# EAGLE design PCB Telemetria 2020 (EAGLE 9.5.2)

## Sheet 1 of 3: TBEAM
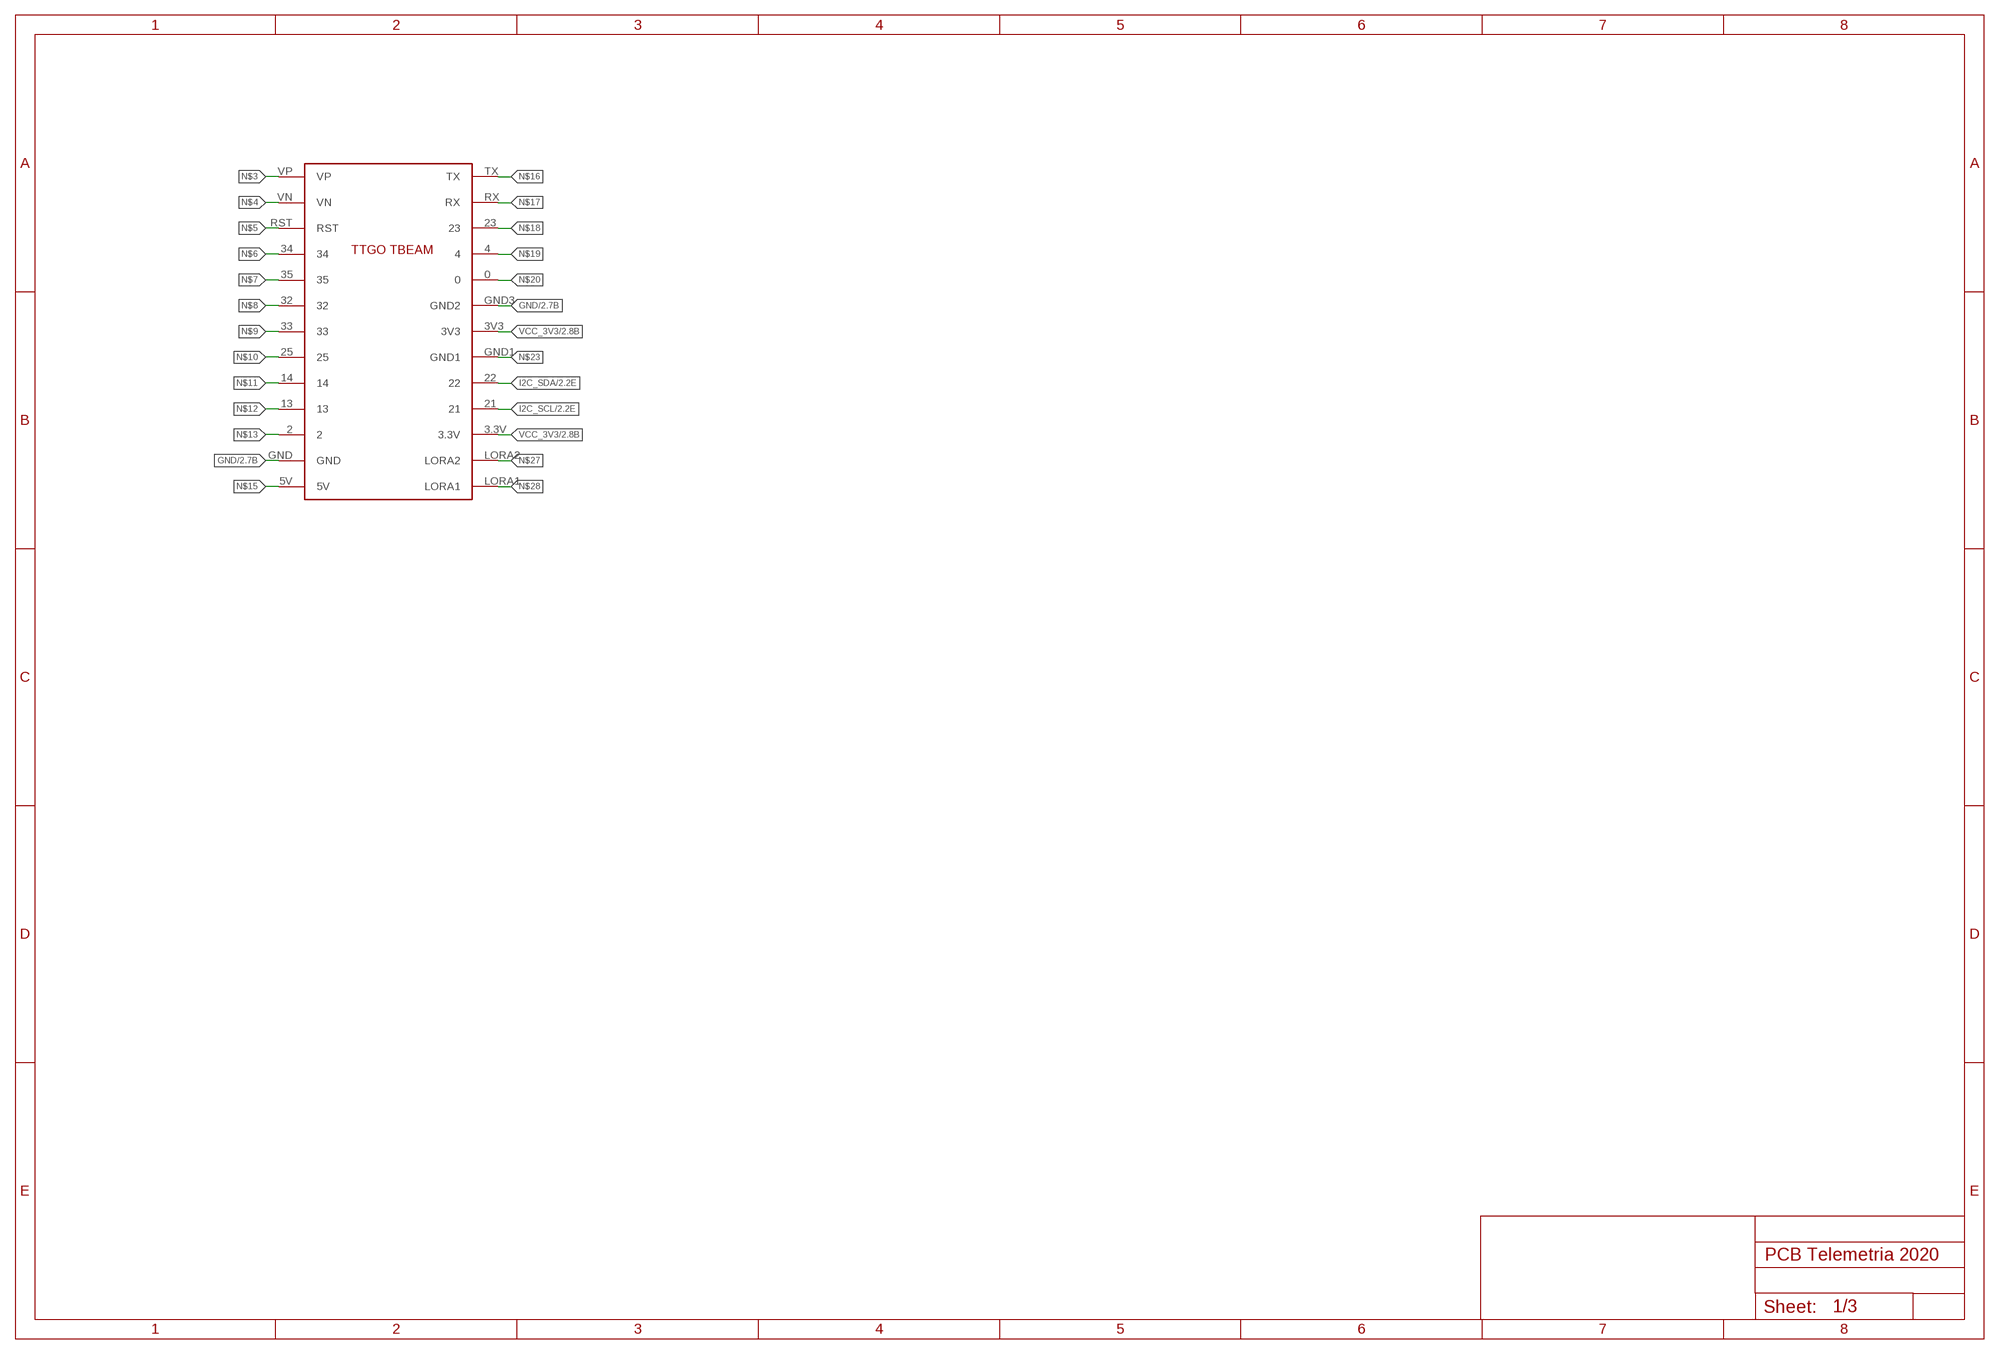
[diagram p0: schematic, sheet 1]

### Parts
U$1  TTGOBEAM  [TTGOBEAM]

### Nets
GND: U$1.GND U$1.GND3(GND2) ; also sheet 2,3
I2C_SCL: U$1.21 ; also sheet 2
I2C_SDA: U$1.22 ; also sheet 2
N$3: U$1.VP
N$4: U$1.VN
N$5: U$1.RST
N$6: U$1.34
N$7: U$1.35
N$8: U$1.32
N$9: U$1.33
N$10: U$1.25
N$11: U$1.14
N$12: U$1.13
N$13: U$1.2
N$15: U$1.5V
N$16: U$1.TX
N$17: U$1.RX
N$18: U$1.23
N$19: U$1.4
N$20: U$1.0
N$23: U$1.GND1
N$27: U$1.LORA2
N$28: U$1.LORA1
VCC_3V3: U$1.3.3V U$1.3V3 ; also sheet 2,3

## Sheet 2 of 3: Analog Circuits
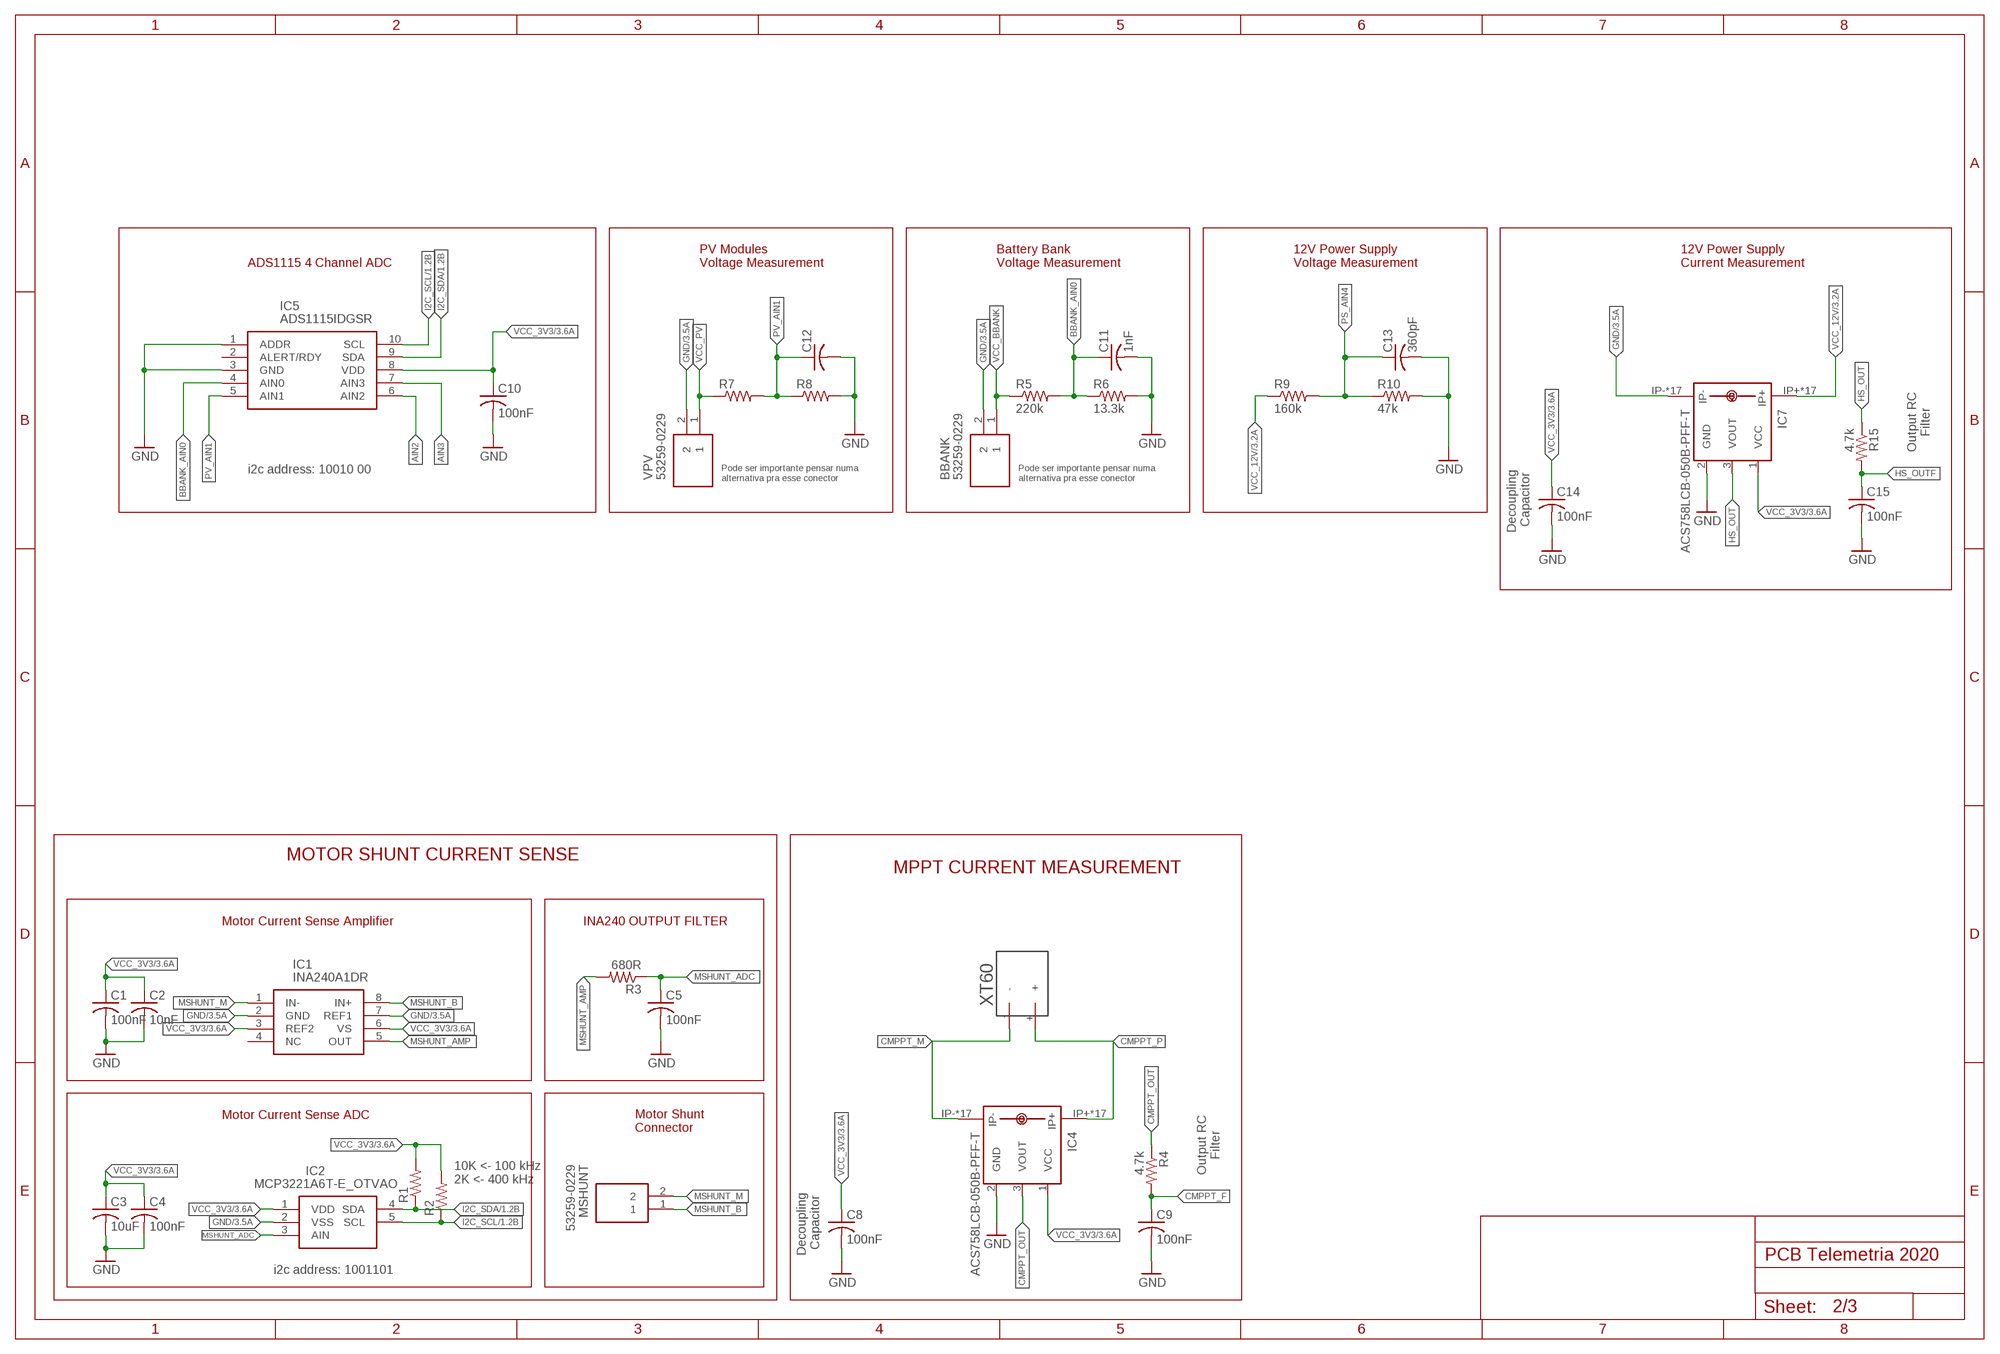
[diagram p1: schematic, sheet 2]

### Parts
BBANK  53259-0229  [0532590229]
C1  100nF  C-USC0805  [C0805]
C2  10nF  C-USC0805  [C0805]
C3  10uF  C-USC0805  [C0805]
C4  100nF  C-USC0805  [C0805]
C5  100nF  C-USC0805  [C0805]
C8  100nF  C-USC0805  [C0805]
C9  100nF  C-USC0805  [C0805]
C10  100nF  C-USC0805  [C0805]
C11  1nF  C-USC0805  [C0805]
C12  C-USC0805  [C0805]
C13  360pF  C-USC0805  [C0805]
C14  100nF  C-USC0805  [C0805]
C15  100nF  C-USC0805  [C0805]
IC1  INA240A1DR  [SOIC127P600X175-8N]
IC2  MCP3221A6T-E_OTVAO  [SOT95P280X145-5N]
IC4  ACS758LCB-050B-PFF-T  [CB-PFF]
IC5  ADS1115IDGSR  [SOP50P490X110-10N]
IC7  ACS758LCB-050B-PFF-T  [CB-PFF]
MSHUNT  53259-0229  [0532590229]
R1  R-US_R0805  [R0805]
R2  R-US_R0805  [R0805]
R3  680R  R-US_R0805  [R0805]
R4  4.7k  R-US_R0805  [R0805]
R5  220k  R-US_R0805  [R0805]
R6  13.3k  R-US_R0805  [R0805]
R7  R-US_R0805  [R0805]
R8  R-US_R0805  [R0805]
R9  160k  R-US_R0805  [R0805]
R10  47k  R-US_R0805  [R0805]
R15  4.7k  R-US_R0805  [R0805]
U$3  XT60  [XT60]
VPV  53259-0229  [0532590229]

### Nets
AIN2: IC5.6(AIN2)
AIN3: IC5.7(AIN3)
BBANK_AIN0: C11.1 IC5.4(AIN0) R5.2 R6.1
CMPPT_F: C9.1 R4.2
CMPPT_M: IC4.IP- IC4.IP-@2(IP-) IC4.IP-@3(IP-) IC4.IP-@4(IP-) IC4.IP-@5(IP-) IC4.IP-@6(IP-) IC4.IP-@7(IP-) IC4.IP-@8(IP-) IC4.IP-@9(IP-) IC4.IP-@10(IP-) IC4.IP-@11(IP-) IC4.IP-@12(IP-) IC4.IP-@13(IP-) IC4.IP-@14(IP-) IC4.IP-@15(IP-) IC4.IP-@16(IP-) IC4.IP-@17(IP-) U$3.-
CMPPT_OUT: IC4.3(VOUT) R4.1
CMPPT_P: IC4.IP+ IC4.IP+@2(IP+) IC4.IP+@3(IP+) IC4.IP+@4(IP+) IC4.IP+@5(IP+) IC4.IP+@6(IP+) IC4.IP+@7(IP+) IC4.IP+@8(IP+) IC4.IP+@9(IP+) IC4.IP+@10(IP+) IC4.IP+@11(IP+) IC4.IP+@12(IP+) IC4.IP+@13(IP+) IC4.IP+@14(IP+) IC4.IP+@15(IP+) IC4.IP+@16(IP+) IC4.IP+@17(IP+) U$3.+
GND: BBANK.2 C1.2 C2.2 C3.2 C4.2 C5.2 C8.2 C9.2 C10.2 C11.2 C12.2 C13.2 C14.2 C15.2 IC1.2(GND) IC1.7(REF1) IC2.2(VSS) IC4.2(GND) IC5.1(ADDR) IC5.3(GND) IC7.2(GND) IC7.IP- IC7.IP-@2(IP-) IC7.IP-@3(IP-) IC7.IP-@4(IP-) IC7.IP-@5(IP-) IC7.IP-@6(IP-) IC7.IP-@7(IP-) IC7.IP-@8(IP-) IC7.IP-@9(IP-) IC7.IP-@10(IP-) IC7.IP-@11(IP-) IC7.IP-@12(IP-) IC7.IP-@13(IP-) IC7.IP-@14(IP-) IC7.IP-@15(IP-) IC7.IP-@16(IP-) IC7.IP-@17(IP-) R6.2 R8.2 R10.2 VPV.2 ; also sheet 1,3
HS_OUT: IC7.3(VOUT) R15.1
HS_OUTF: C15.1 R15.2
I2C_SCL: IC2.5(SCL) IC5.10(SCL) R2.1 ; also sheet 1
I2C_SDA: IC2.4(SDA) IC5.9(SDA) R1.1 ; also sheet 1
MSHUNT_ADC: C5.1 IC2.3(AIN) R3.1
MSHUNT_AMP: IC1.5(OUT) R3.2
MSHUNT_B: IC1.8(IN+) MSHUNT.1
MSHUNT_M: IC1.1(IN-) MSHUNT.2
PS_AIN4: C13.1 R9.2 R10.1
PV_AIN1: C12.1 IC5.5(AIN1) R7.2 R8.1
VCC_3V3: C1.1 C2.1 C3.1 C4.1 C8.1 C10.1 C14.1 IC1.3(REF2) IC1.6(VS) IC2.1(VDD) IC4.1(VCC) IC5.8(VDD) IC7.1(VCC) R1.2 R2.2 ; also sheet 1,3
VCC_12V: IC7.IP+ IC7.IP+@2(IP+) IC7.IP+@3(IP+) IC7.IP+@4(IP+) IC7.IP+@5(IP+) IC7.IP+@6(IP+) IC7.IP+@7(IP+) IC7.IP+@8(IP+) IC7.IP+@9(IP+) IC7.IP+@10(IP+) IC7.IP+@11(IP+) IC7.IP+@12(IP+) IC7.IP+@13(IP+) IC7.IP+@14(IP+) IC7.IP+@15(IP+) IC7.IP+@16(IP+) IC7.IP+@17(IP+) R9.1 ; also sheet 3
VCC_BBANK: BBANK.1 R5.1
VCC_PV: R7.1 VPV.1
Unconnected: IC1.4(NC) IC5.2(ALERT/RDY)

### Notes on the sheet
- ADS1115 4 Channel ADC
- PV Modules
  Voltage Measurement
- Battery Bank
  Voltage Measurement
- 12V Power Supply
  Voltage Measurement
- 12V Power Supply
  Current Measurement
- Output RC
  Filter
- i2c address: 10010 00
- Pode ser importante pensar numa
  alternativa pra esse conector
- Pode ser importante pensar numa
  alternativa pra esse conector
- Decoupling 
  Capacitor
- MOTOR SHUNT CURRENT SENSE
- MPPT CURRENT MEASUREMENT
- Motor Current Sense Amplifier | INA240 OUTPUT FILTER
- Motor Current Sense ADC
- Motor Shunt 
  Connector
- Output RC
  Filter
- 10K <- 100 kHz
  2K <- 400 kHz
- Decoupling 
  Capacitor
- i2c address: 1001101

## Sheet 3 of 3: Power
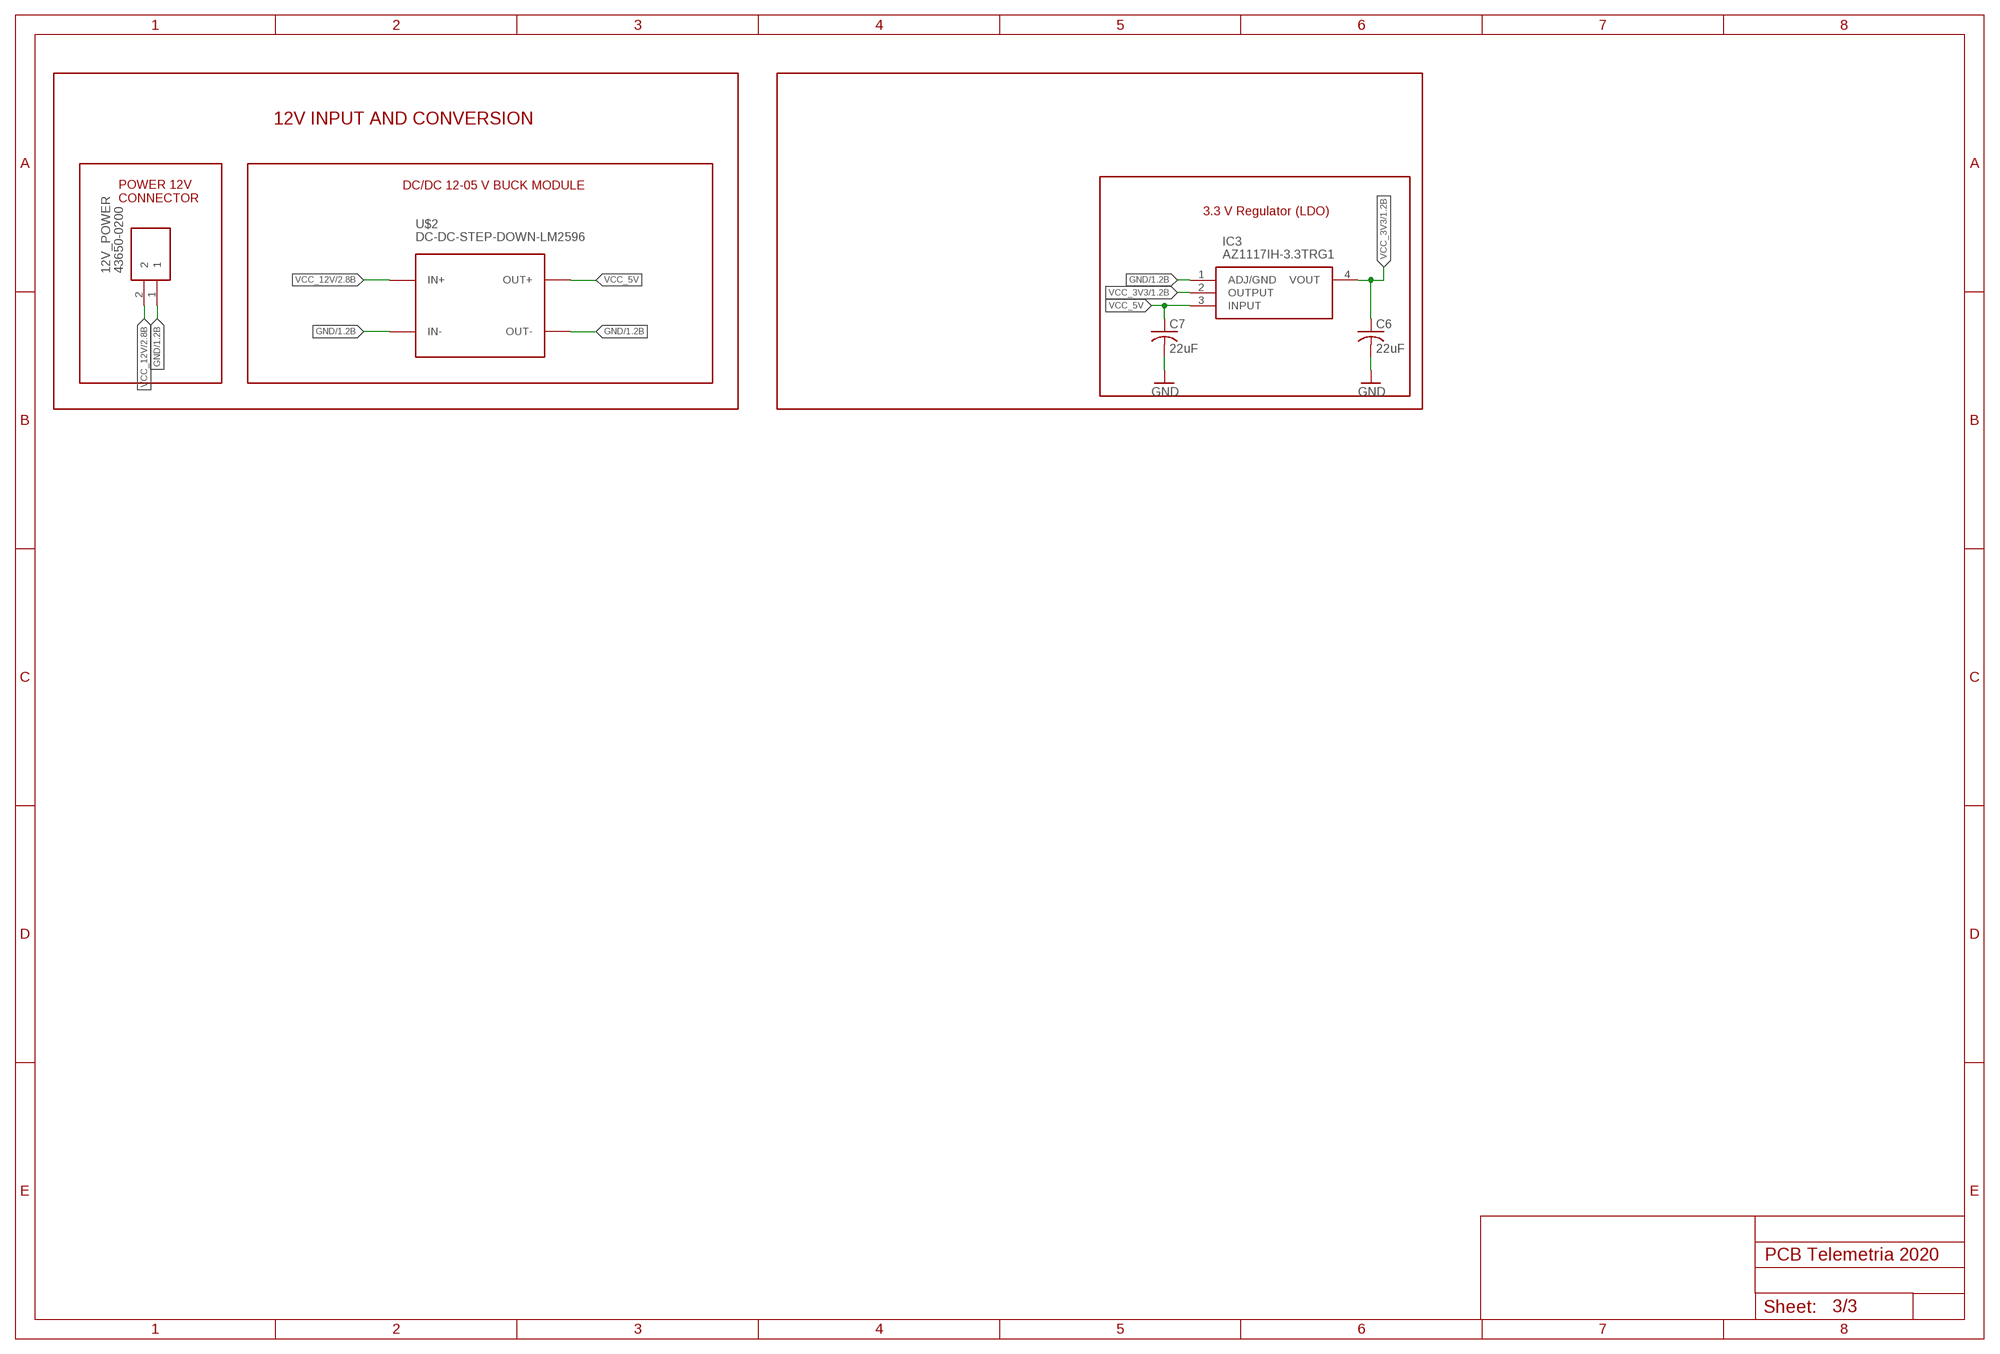
[diagram p2: schematic, sheet 3]

### Parts
12V_POWER  43650-0200  [43650-0200]
C6  22uF  C-USC0805  [C0805]
C7  22uF  C-USC0805  [C0805]
IC3  AZ1117IH-3.3TRG1  [SOT230P700X170-4N]
U$2  DC-DC-STEP-DOWN-LM2596  [DC-DC-STEP-DOWN-LM2596]

### Nets
GND: 12V_POWER.1 C6.2 C7.2 IC3.1(ADJ/GND) U$2.IN- U$2.OUT- ; also sheet 1,2
VCC_3V3: C6.1 IC3.2(OUTPUT) IC3.4(VOUT) ; also sheet 1,2
VCC_5V: C7.1 IC3.3(INPUT) U$2.OUT+
VCC_12V: 12V_POWER.2 U$2.IN+ ; also sheet 2

### Notes on the sheet
- 12V INPUT AND CONVERSION
- DC/DC 12-05 V BUCK MODULE
- POWER 12V
  CONNECTOR
- 3.3 V Regulator (LDO)

## Library data of the parts
12V_POWER = 43650-0200:43650-0200: Header 3.00mm, WTB single row, RA, 2w Molex MICRO-FIT 3.0 Series, Series Number 43650, 3mm Pitch 2 Way 1 Row Shrouded Right Angle PCB Header, Through Hole Source: Datasheet <http://www.molex.com/pdm_docs/sd/436500200_sd.pdf>; DESCRIPTION: Header 3.00mm, WTB single row, RA, 2w Molex MICRO-FIT 3.0 Series, Series Number 43650, 3mm Pitch 2 Way 1 Row Shrouded Right Angle PCB Header, Through Hole; HEIGHT: mm; MANUFACTURER_NAME: Molex; MANUFACTURER_PART_NUMBER: 43650-0200; MOUSER_PART_NUMBER: 538-43650-0200; MOUSER_PRICE-STOCK: https://www.mouser.co.uk/ProductDetail/Molex/43650-0200?qs=HlEFOAM0q6XGaAJJj3Pssw%3D%3D
BBANK MSHUNT VPV = CON_MOLEX_53259-0229:53259-0229: Headers & Wire Housings 3.5 WtB Wafer Assy R B Wafer Assy RA 2Ckt Source: Datasheet <https://www.molex.com/webdocs/datasheets/pdf/en-us/0532590229_PCB_HEADERS.pdf>; DESCRIPTION: Headers & Wire Housings 3.5 WtB Wafer Assy R B Wafer Assy RA 2Ckt; HEIGHT: 7mm; MANUFACTURER_NAME: Molex; MANUFACTURER_PART_NUMBER: 53259-0229; MOUSER_PART_NUMBER: 538-53259-0229; MOUSER_PRICE-STOCK: https://www.mouser.co.uk/ProductDetail/Molex/53259-0229?qs=%2Fy5FSpUmAiGN4PmFvaThpA%3D%3D
C1-C15 = rcl:C-US: CAPACITOR, American symbol; SPICEPREFIX: C
IC1 = INA240A1DR:INA240A1DR: 80V, Low-/High-Side, Bi-Directional, Zero-Drift, Current Sense Amp w/Enhanced PWM Rejection Source: Datasheet <http://www.ti.com/lit/gpn/ina240>; DESCRIPTION: 80V, Low-/High-Side, Bi-Directional, Zero-Drift, Current Sense Amp w/Enhanced PWM Rejection; HEIGHT: 1.75mm; MANUFACTURER_NAME: Texas Instruments; MANUFACTURER_PART_NUMBER: INA240A1DR; MOUSER_PART_NUMBER: 595-INA240A1DR; MOUSER_PRICE-STOCK: https://www.mouser.co.uk/ProductDetail/Texas-Instruments/INA240A1DR?qs=AQlKX63v8Rv7XB07RTzuHA%3D%3D
IC2 = MCP3221A6T-E_OTVAO:MCP3221A6T-E_OTVAO: Analog to Digital Converters - ADC Automotive, 12-bit SAR ADC, I2C, single channel Source: Datasheet <https://www.arrow.com/en/products/mcp3221a6t-eotvao/microchip-technology>; DESCRIPTION: Analog to Digital Converters - ADC Automotive, 12-bit SAR ADC, I2C, single channel; HEIGHT: 1.45mm; MANUFACTURER_NAME: Microchip; MANUFACTURER_PART_NUMBER: MCP3221A6T-E/OTVAO; MOUSER_PART_NUMBER: 579-MCP3221A6TEOTVAO; MOUSER_PRICE-STOCK: https://www.mouser.co.uk/ProductDetail/Microchip-Technology/MCP3221A6T-E-OTVAO?qs=5aG0NVq1C4xIe7K3D%2FHE6g%3D%3D
IC3 = AZ1117IH-3.3TRG1:AZ1117IH-3.3TRG1: LDO Voltage Regulators LDO BJT HiCurr 1.35A 10Hz to 10KHz Source: Datasheet; DESCRIPTION: LDO Voltage Regulators LDO BJT HiCurr 1.35A 10Hz to 10KHz; HEIGHT: 1.7mm; MANUFACTURER_NAME: Diodes Inc.; MANUFACTURER_PART_NUMBER: AZ1117IH-3.3TRG1; MOUSER_PART_NUMBER: 621-AZ1117IH-3.3TRG1; MOUSER_PRICE-STOCK: https://www.mouser.co.uk/ProductDetail/Diodes-Incorporated/AZ1117IH-33TRG1?qs=cpo3%2FpBou2jnS4SxLgAVoA%3D%3D
IC4 IC7 = allegro:ACS758*: Thermally Enhanced, Fully Integrated, Hall Effect-Based Linear Current Sensor with 100 micro Ohm Current Conductor display layer 49 Reference in BRD and place VIAs on circles Source: http://www.allegromicro.com/en/Products/Part_Numbers/0758/0758.pdf; MPN: ACS758LCB-050B-PFF-T; OC_FARNELL: 1718997; OC_NEWARK: 04R7131
IC5 = SamacSys_Parts:ADS1115IDGSR: 16-Bit 860SPS 4-Ch Delta-Sigma ADC With PGA, Oscillator, Vref, Comparator, and I2C Source: Datasheet <http://www.ti.com/lit/gpn/ADS1115>; DESCRIPTION: 16-Bit 860SPS 4-Ch Delta-Sigma ADC With PGA, Oscillator, Vref, Comparator, and I2C; HEIGHT: 1.1mm; MANUFACTURER_NAME: Texas Instruments; MANUFACTURER_PART_NUMBER: ADS1115IDGSR; MOUSER_PART_NUMBER: 595-ADS1115IDGSR; MOUSER_PRICE-STOCK: https://www.mouser.co.uk/ProductDetail/Texas-Instruments/ADS1115IDGSR?qs=IK5e5L0zOXjKCJoVMhYO%2FQ%3D%3D
R1-R10 R15 = rcl:R-US_: RESISTOR, American symbol; SPICEPREFIX: R
U$1 = bibliotecattgo:TTGOBEAM
U$2 = diy-modules:DC-DC-STEP-DOWN-LM2596: DC/DC Step-Down Regulator based on LM2596-ADJ chip LM2596 datasheet available here: http://www.ti.com/lit/ds/symlink/lm2596.pdf Click here to find device on ebay.com <http://www.ebay.com/sch/lm2596+power+regulator>
U$3 = XT60:XT60: XT60

## Board
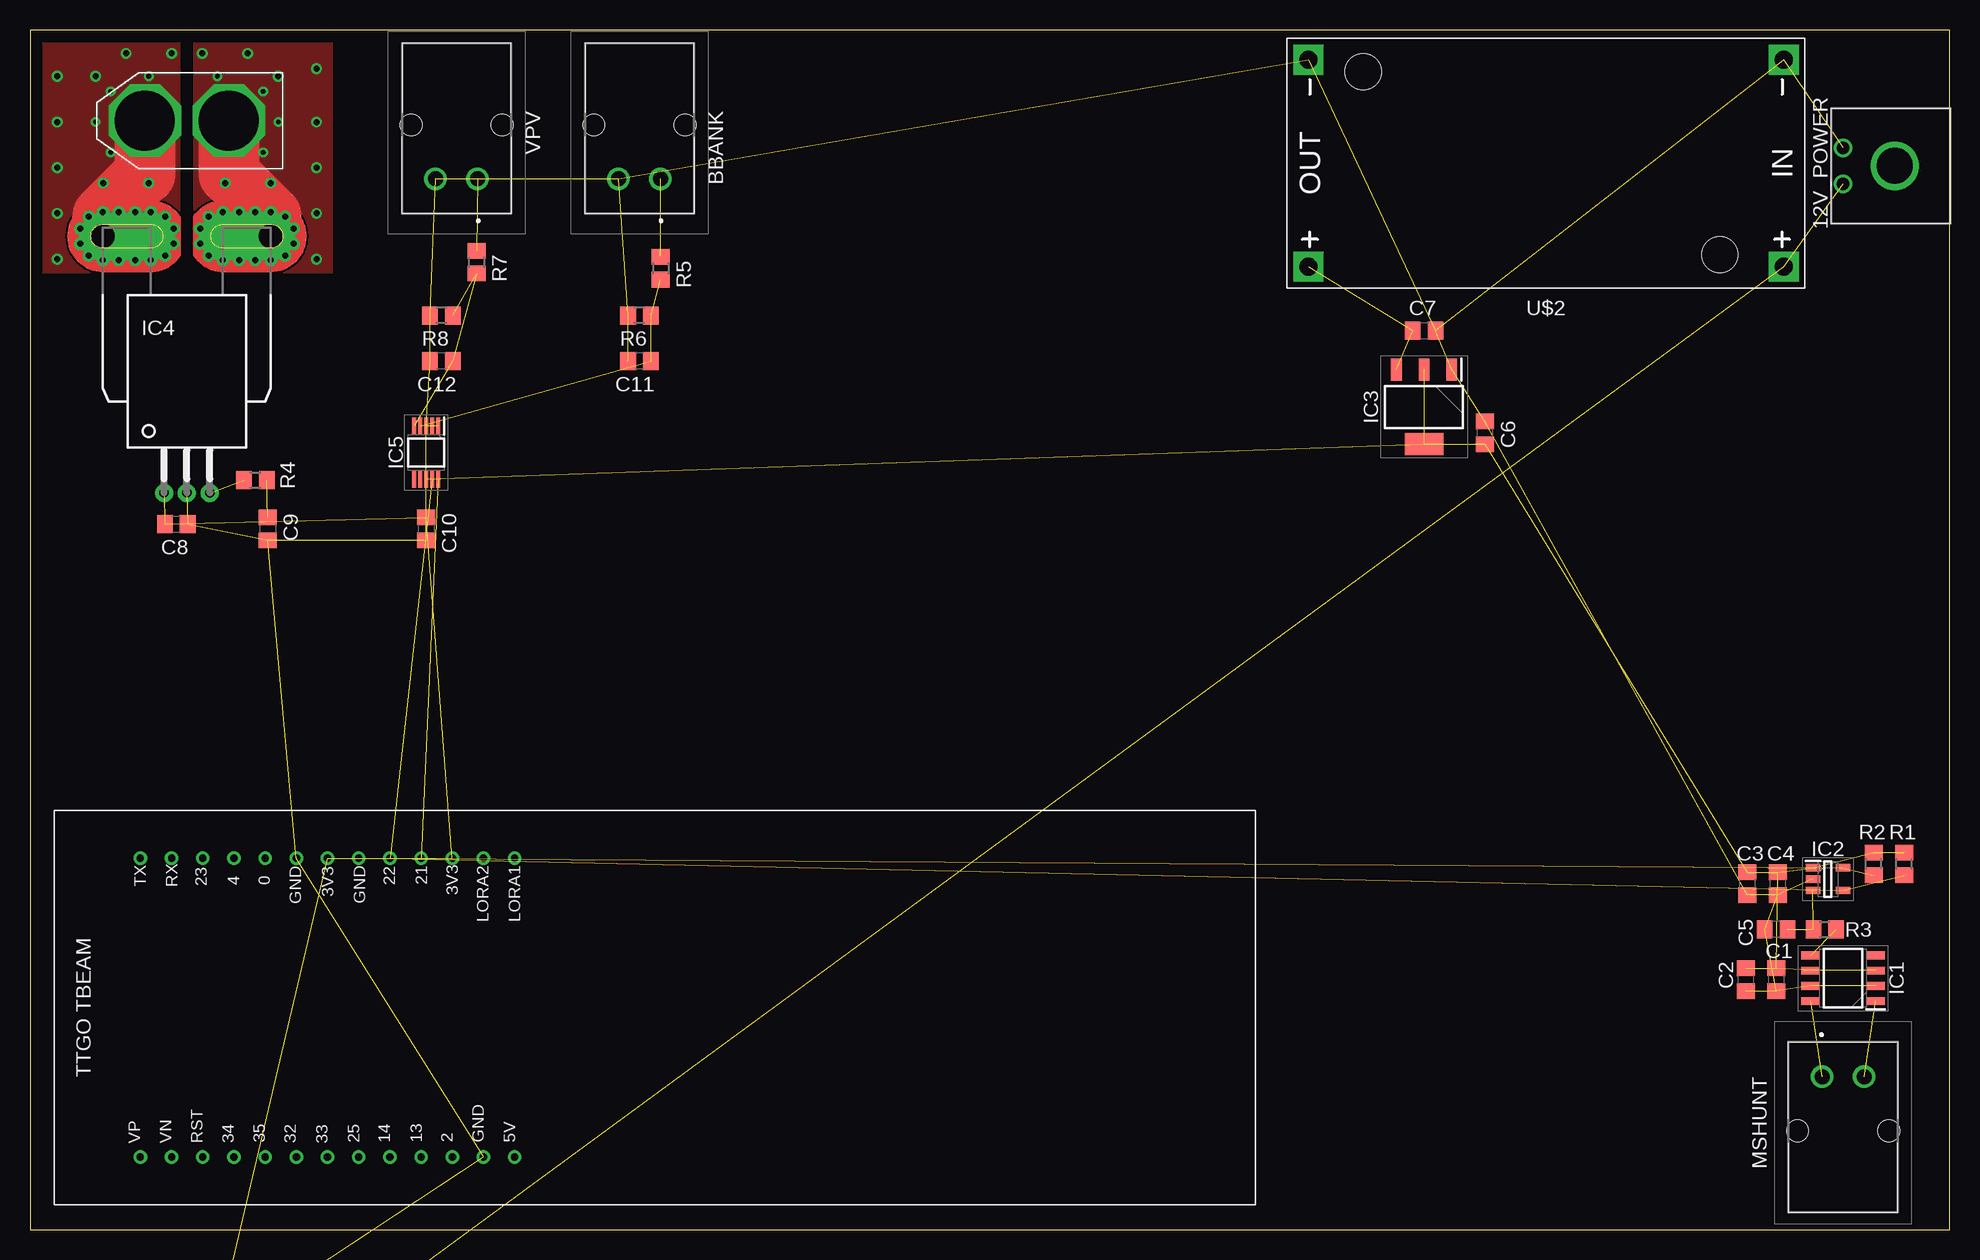
[diagram p3: board, top side]
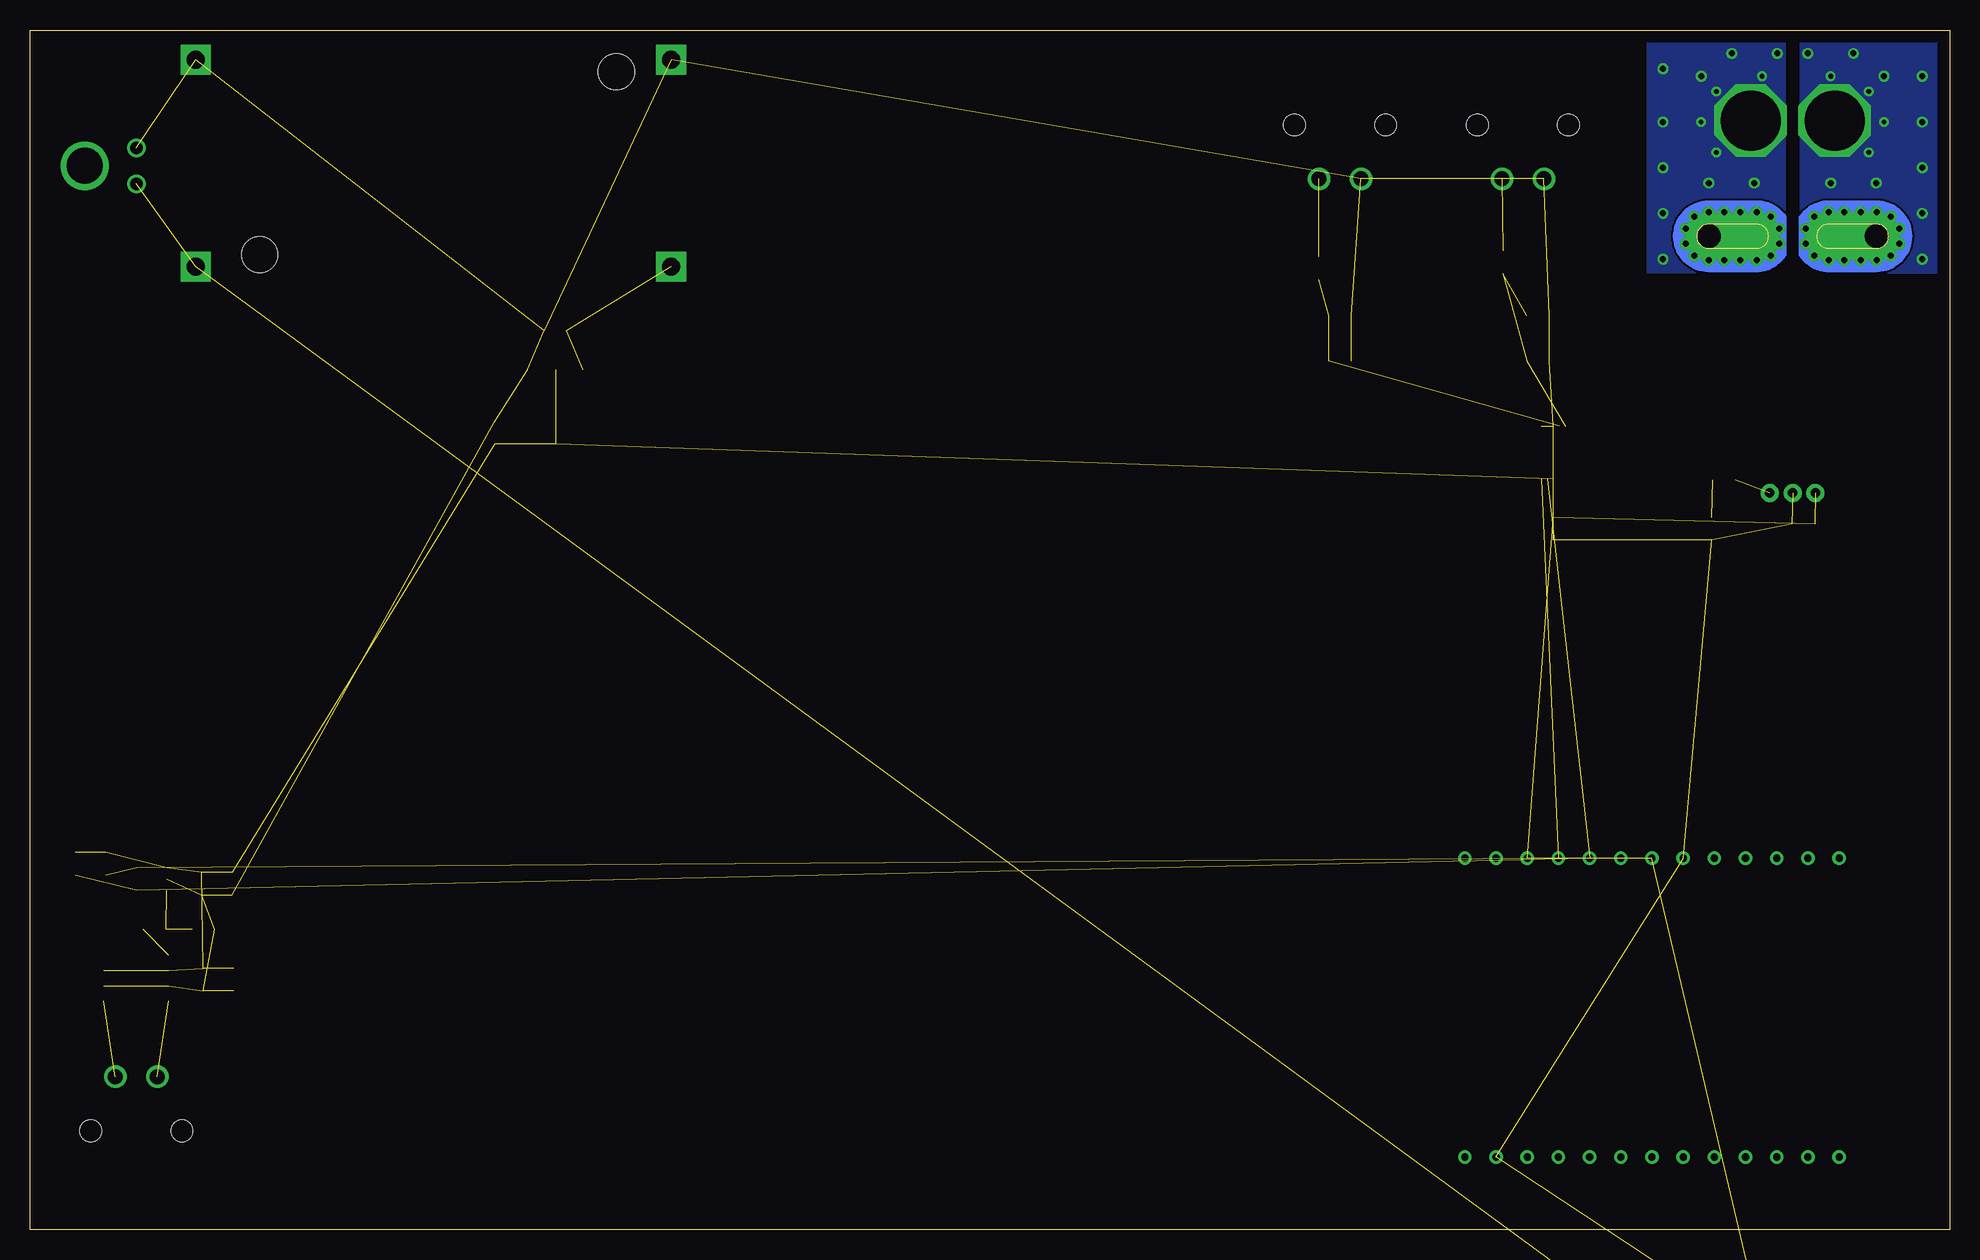
[diagram p4: board, bottom side, seen from below]

Size 160 x 100 mm. Coordinates in mm from the lower left corner, seen from the top.
Outline: 0,0 160,0 160,100 0,100 0,0
Copper layers (1*16): Top 0.035mm / dielectric 1.5mm / Bottom 0.035mm
Design rules "default *": minimum track width 6mil, minimum drill 0.35mm, track to track 6mil, track to pad 6mil, pad to pad 6mil, via to via 6mil, smd to smd 6mil, copper to edge 40mil, drill to drill 6mil, minimum pad ring 10mil, minimum via ring 8mil, stop-mask expansion 4mil, vias tented up to drill 0mil, thermal gap 10mil

### Footprints (pad centres in the part's own frame; a part is rotated, then mirrored left to right if it is on the bottom)
43650-0200 = drill 1.02 pad 1.52: 1 0,0; 2 -3,0 | drill 3 pad 3: 3 -1.5,-4.32
0532590229 = drill 1.25 pad 1.875: 1 -1.75,3.85; 2 1.75,3.85 | hole 1.8: 3.8,-0.65; -3.8,-0.65
C0805 = smd 1.3 x 1.5: 1 -0.95,0; 2 0.95,0
SOIC127P600X175-8N = smd 1.528 x 0.65: 1 -2.711,1.905; 2 -2.711,0.635; 3 -2.711,-0.635; 4 -2.711,-1.905; 5 2.711,-1.905; 6 2.711,-0.635; 7 2.711,0.635; 8 2.711,1.905
SOT95P280X145-5N = smd 1.2 x 0.6: 1 -1.25,0.95; 2 -1.25,0; 3 -1.25,-0.95; 4 1.25,-0.95; 5 1.25,0.95
SOT230P700X170-4N = smd 1.85 x 0.9: 1 -3.1,2.3; 2 -3.1,0; 3 -3.1,-2.3 | smd 1.85 x 3.2: 4 3.1,0
CB-PFF = drill 0.8 pad 1.5: 1 -1.91,-21.4; 2 0,-21.4; 3 1.91,-21.4 | drill 2 pad 4 offset: IP+ 7,0; IP- -7,0 | drill 0.5 pad 0.9: IP+@2 8.89,0.635; IP+@3 8.89,-0.635; IP+@4 8.175,-1.625; IP+@5 7,-2; IP+@6 5.675,-2; IP+@7 4.35,-2; IP+@8 3,-2; IP+@9 1.825,-1.625; IP+@10 1.1,-0.625; IP+@11 1.1,0.625; IP+@12 1.825,1.625; IP+@13 3,2; IP+@14 4.35,2; IP+@15 5.675,2; IP+@16 7,2; IP+@17 8.175,1.625; IP-@2 -8.89,0.635; IP-@3 -8.89,-0.635; IP-@4 -8.175,-1.625; IP-@5 -7,-2; IP-@6 -5.675,-2; IP-@7 -4.325,-2; IP-@8 -3,-2; IP-@9 -1.825,-1.625; IP-@10 -1.1,-0.625; IP-@11 -1.1,0.625; IP-@12 -1.825,1.625; IP-@13 -3,2; IP-@14 -4.325,2; IP-@15 -5.675,2; IP-@16 -7,2; IP-@17 -8.175,1.625
SOP50P490X110-10N = smd 1.4 x 0.3: 1 -2.2,1; 2 -2.2,0.5; 3 -2.2,0; 4 -2.2,-0.5; 5 -2.2,-1; 6 2.2,-1; 7 2.2,-0.5; 8 2.2,0; 9 2.2,0.5; 10 2.2,1
R0805 = smd 1.3 x 1.5: 1 -0.95,0; 2 0.95,0
TTGOBEAM = drill 0.6: 0 11.9,5.8; 2 -13,-9.8; 3.3V 11.9,-9.8; 3V3 11.9,0.6; 4 11.9,8.4; 5V -13,-15; 13 -13,-7.2; 14 -13,-4.6; 21 11.9,-7.2; 22 11.9,-4.6; 23 11.9,11; 25 -13,-2; 32 -13,3.2; 33 -13,0.6; 34 -13,8.4; 35 -13,5.8; GND -13,-12.4; GND1 11.9,-2; GND3 11.9,3.2; LORA1 11.9,-15; LORA2 11.9,-12.4; RST -13,11; RX 11.9,13.6; TX 11.9,16.2; VN -13,13.6; VP -13,16.2
DC-DC-STEP-DOWN-LM2596 = drill 1.5 pad 2.5 square: IN+ -19.812,8.636; IN- -19.812,-8.636; OUT+ 19.812,8.636; OUT- 19.812,-8.636 | hole 3: -14.478,7.62; 15.24,-7.62
XT60 = drill 5 octagon: + 4.5,0; - 11.5,0

### Placement (x,y rotation side)
12V_POWER  151.13,90.17 90 top
BBANK  50.8,91.44 180 top
C1  145.54,20.83 270 top
C2  143,20.83 270 top
C3  143.13,28.83 270 top
C4  145.67,28.83 270 top
C5  145.54,25.02 180 top
C6  121.28,66.42 90 top
C7  116.2,74.93 0 top
C8  12.19,58.8 0 top
C9  19.81,58.42 270 top
C10  33.02,58.42 270 top
C11  50.8,72.39 180 top
C12  34.29,72.39 180 top
C13  3.81,-38.1 0 top  (outside the outline)
C14  10.16,-38.1 0 top  (outside the outline)
C15  16.51,-38.1 0 top  (outside the outline)
IC1  151.13,20.95 180 top
IC2  149.86,29.21 0 top
IC3  116.2,68.58 270 top
IC4  13.08,82.8 0 top
IC5  33.02,64.77 270 top
IC7  11.43,-12.7 0 top  (outside the outline)
MSHUNT  151.13,8.89 0 top
R1  156.21,30.48 90 top
R2  153.67,30.48 90 top
R3  149.61,25.02 0 top
R4  18.8,62.48 0 top
R5  52.58,80.14 270 top
R6  50.8,76.2 180 top
R7  37.21,80.64 270 top
R8  34.29,76.2 180 top
R9  22.86,-38.1 0 top  (outside the outline)
R10  3.81,-44.45 0 top  (outside the outline)
R15  29.21,-38.1 0 top  (outside the outline)
U$1  25.4,19.05 90 top
U$2  126.36,88.9 180 top
U$3  21.08,92.46 180 top
VPV  35.56,91.44 180 top

### Tracks (layer width: path | path; a pad name or v marks a point on that pad's centre or on a via)
BBANK_AIN0  (3 unrouted)
CMPPT_F  (1 unrouted)
CMPPT_M  (via drill 0.4 pad 0.55, 0.5 pad 0.75)
  Top 5.08: IC4.IP- 6.08,84.51 9.58,88.01 U$3.-
  other vias: 2.29,80.9 2.29,84.71 2.29,88.52 2.29,92.33 2.29,96.14 6.1,87.25 9.91,87.25 5.46,96.14 8,98.04 11.81,98.04 9.91,96.14 6.73,94.87 5.46,92.33 6.73,89.79
  pour Top (no thermals): 1.02,79.76 1.02,98.93 12.45,98.93 12.45,79.76
  pour Bottom (no thermals): 1.02,79.76 1.02,98.93 12.45,98.93 12.45,79.76
CMPPT_OUT  (1 unrouted)
CMPPT_P  (via drill 0.4 pad 0.55, 0.5 pad 0.75)
  Top 5.08: U$3.+ 16.58,88.01 20.08,84.51 IC4.IP+
  other vias: 16.26,87.25 23.88,80.9 23.88,84.71 23.88,88.52 20.07,87.25 23.88,92.33 23.88,96.77 20.7,96.14 18.16,98.04 14.35,98.04 19.43,89.79 20.7,92.33 19.43,94.87 15.62,96.14
  pour Top (no thermals): 25.15,98.93 25.15,79.76 13.72,79.76 13.72,98.93
  pour Bottom (no thermals): 13.72,98.93 13.72,79.76 25.15,79.76 25.15,98.93
GND  (33 unrouted)
HS_OUT  (1 unrouted)
HS_OUTF  (1 unrouted)
I2C_SCL  (3 unrouted)
I2C_SDA  (3 unrouted)
MSHUNT_ADC  (2 unrouted)
MSHUNT_AMP  (1 unrouted)
MSHUNT_B  (1 unrouted)
MSHUNT_M  (1 unrouted)
PS_AIN4  (2 unrouted)
PV_AIN1  (3 unrouted)
VCC_3V3  (19 unrouted)
VCC_5V  (2 unrouted)
VCC_12V  (3 unrouted)
VCC_BBANK  (1 unrouted)
VCC_PV  (1 unrouted)